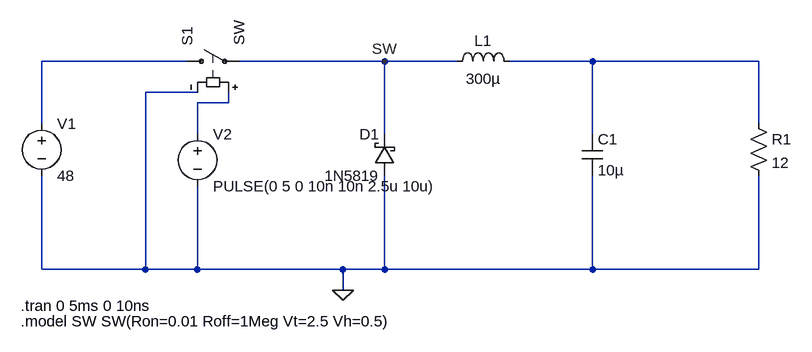
[diagram p0: schematic DC-DC BUCK CONVERTER.asc]
DC-DC BUCK CONVERTER.asc, the LTspice schematic file:
Version 4.1
SHEET 1 880 680
WIRE -656 -304 -880 -304
WIRE -352 -304 -576 -304
WIRE -240 -304 -352 -304
WIRE -32 -304 -160 -304
WIRE 224 -304 -32 -304
WIRE -640 -256 -720 -256
WIRE -592 -240 -592 -256
WIRE -592 -240 -640 -240
WIRE -880 -208 -880 -304
WIRE 224 -208 224 -304
WIRE -640 -192 -640 -240
WIRE -352 -192 -352 -304
WIRE -32 -192 -32 -304
WIRE -880 16 -880 -128
WIRE -720 16 -720 -256
WIRE -720 16 -880 16
WIRE -640 16 -640 -112
WIRE -640 16 -720 16
WIRE -416 16 -640 16
WIRE -352 16 -352 -128
WIRE -352 16 -416 16
WIRE -32 16 -32 -128
WIRE -32 16 -352 16
WIRE 224 16 224 -128
WIRE 224 16 -32 16
WIRE -416 48 -416 16
FLAG -416 48 0
FLAG -352 -304 SW
SYMBOL voltage -880 -224 R0
WINDOW 123 0 0 Left 0
WINDOW 39 0 0 Left 0
SYMATTR InstName V1
SYMATTR Value 48
SYMBOL voltage -640 -208 R0
WINDOW 123 0 0 Left 0
WINDOW 39 0 0 Left 0
SYMATTR InstName V2
SYMATTR Value PULSE(0 5 0 10n 10n 2.5u 10u)
SYMBOL cap -48 -192 R0
SYMATTR InstName C1
SYMATTR Value 10µ
SYMBOL res 208 -224 R0
SYMATTR InstName R1
SYMATTR Value 12
SYMBOL sw -672 -304 R270
SYMATTR InstName S1
SYMBOL ind -256 -288 R270
WINDOW 0 32 56 VTop 2
WINDOW 3 5 56 VBottom 2
SYMATTR InstName L1
SYMATTR Value 300µ
SYMATTR SpiceLine Rser=1m
SYMBOL schottky -336 -128 R180
WINDOW 0 24 64 Left 2
WINDOW 3 24 0 Left 2
SYMATTR InstName D1
SYMATTR Value 1N5819
SYMATTR Description Diode
SYMATTR Type diode
TEXT -912 72 Left 2 !.tran 0 5ms 0 10ns
TEXT -912 96 Left 2 !.model SW SW(Ron=0.01 Roff=1Meg Vt=2.5 Vh=0.5)

The netlist it stands for:
* DC-DC BUCK CONVERTER.asc
V1 N001 0 48
V2 N003 0 PULSE(0 5 0 10n 10n 2.5u 10u)
C1 N002 0 10µ
R1 N002 0 12
S1 N001 SW N003 0 SW
L1 SW N002 300µ Rser=1m
D1 0 SW 1N5819
.model D D
.lib standard.dio
.tran 0 5ms 0 10ns
.model SW SW(Ron=0.01 Roff=1Meg Vt=2.5 Vh=0.5)
.backanno
.end